# Altium project PCBIntegrationBoard1.PrjPcb
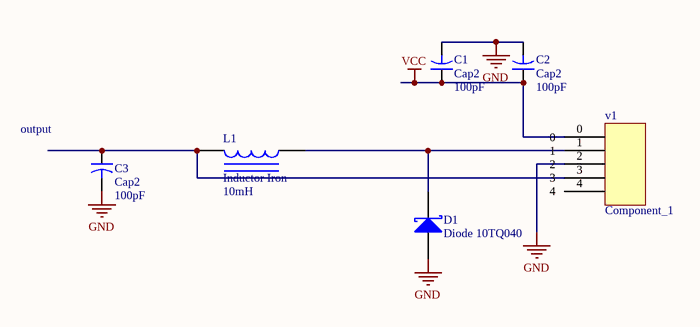
[diagram p0: Power Regulation.SchDoc]
1 sheet, 6 parts. Net scope: global (net labels, ports and power ports of the same name join across sheets).
Board files: Power Regulation.PcbDoc, LEDCube.PcbDoc, Master.PcbDoc, LED Matrix Pcb_Final.PcbDoc, PAM 8403 PCB.PcbDoc

## Sheet Power Regulation.SchDoc
size A

### Parts
C1  Cap2  value 100pF  [CAPR5-4X5]
C2  Cap2  value 100pF  [CAPR5-4X5]
C3  Cap2  value 100pF  [CAPR5-4X5]
D1  Diode 10TQ040  [TO-220AC]
L1  Inductor Iron  value 10mH  [AXIAL-0.9]
v1  Component_1  [Model Name]

### Nets
GND: C1.2 C2.2 C3.2 D1.3(A)
VCC: C1.1 C2.1
NetC3_1: C3.1 L1.2
NetD1_1: D1.1(K) L1.1

Not connected (* = marked no-connect by the designer): v1 0 1 2 3 4

### Notes on the sheet
- (near C3) output

### Library data of the parts
C1-C3 = Cap2: Capacitor; Published: 23-Sep-2002; PackageReference: CAPR5-4X5; Publisher: Altium Limited; PackageDescription: Capacitor; 2 Leads
D1 = Diode 10TQ040: Schottky Rectifier; Note: Terminal 2 is the TAB and is electrically connected to the cathode; Published: 8-Jun-2000; LatestRevisionDate: 17-Jul-2002; LatestRevisionNote: Re-released for DXP Platform.; DatasheetVersion: PD-2.057B; PackageVersion: Feb-1998; PackageReference: TO-220AC; Publisher: Altium Limited; PackageDescription: TO, Thru-Hole, Vertical, Heatsink Mounted; 3 In-Line Leads (1 Absent); Pitch 2.54 mm; ComponentLink1Description: Manufacturer Link; ComponentLink1URL: http://www.irf.com/
L1 = Inductor Iron: Magnetic-Core Inductor; Published: 24-Mar-1999; LatestRevisionDate: 17-Jul-2002; LatestRevisionNote: Re-released for DXP Platform.; PackageReference: AXIAL-0.9; Publisher: Altium Limited; PackageDescription: Axial Device, Thru-Hole; 2 Leads; 0.9 in Pin Spacing